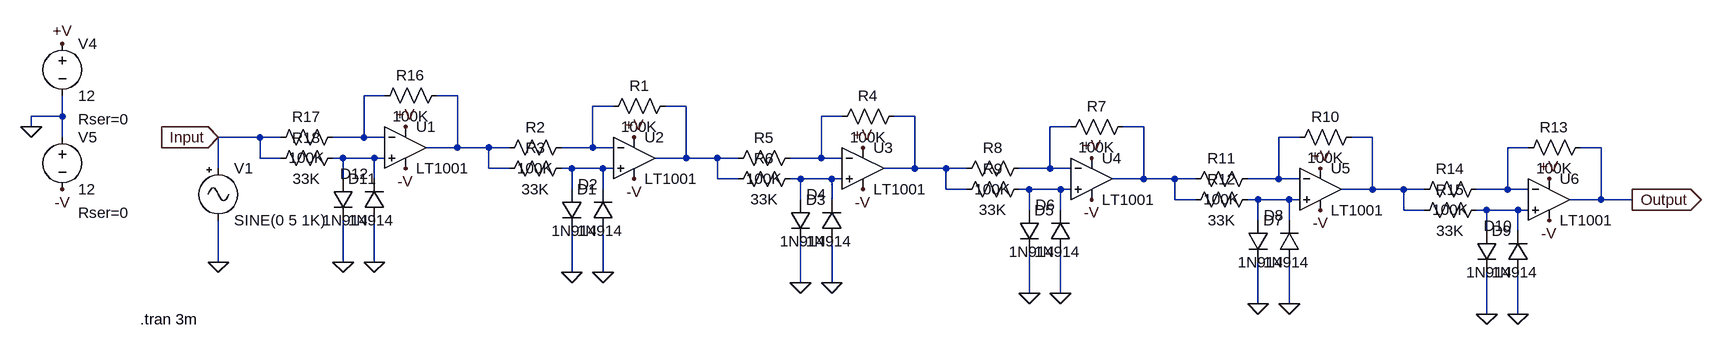
[diagram p0: schematic Serge%20ws2.asc]
Serge%20ws2.asc, the LTspice schematic file:
Version 4
SHEET 1 2140 680
WIRE 80 160 48 160
WIRE 192 160 160 160
WIRE 432 176 400 176
WIRE 544 176 512 176
WIRE -416 192 -416 160
WIRE -416 192 -464 192
WIRE 784 192 752 192
WIRE 896 192 864 192
WIRE -464 208 -464 192
WIRE 1136 208 1104 208
WIRE 1248 208 1216 208
WIRE -416 224 -416 192
WIRE -112 224 -176 224
WIRE -80 224 -112 224
WIRE 48 224 48 160
WIRE 48 224 0 224
WIRE 80 224 48 224
WIRE 1488 224 1456 224
WIRE 1600 224 1568 224
WIRE 192 240 192 160
WIRE 192 240 144 240
WIRE 240 240 192 240
WIRE 272 240 240 240
WIRE 400 240 400 176
WIRE 400 240 352 240
WIRE 432 240 400 240
WIRE 1840 240 1808 240
WIRE 1952 240 1920 240
WIRE -112 256 -112 224
WIRE -80 256 -112 256
WIRE 16 256 0 256
WIRE 64 256 16 256
WIRE 80 256 64 256
WIRE 544 256 544 176
WIRE 544 256 496 256
WIRE 592 256 544 256
WIRE 624 256 592 256
WIRE 752 256 752 192
WIRE 752 256 704 256
WIRE 784 256 752 256
WIRE -176 272 -176 224
WIRE 240 272 240 240
WIRE 272 272 240 272
WIRE 368 272 352 272
WIRE 416 272 368 272
WIRE 432 272 416 272
WIRE 896 272 896 192
WIRE 896 272 848 272
WIRE 944 272 896 272
WIRE 976 272 944 272
WIRE 1104 272 1104 208
WIRE 1104 272 1056 272
WIRE 1136 272 1104 272
WIRE 16 288 16 256
WIRE 64 288 64 256
WIRE 592 288 592 256
WIRE 624 288 592 288
WIRE 720 288 704 288
WIRE 768 288 720 288
WIRE 784 288 768 288
WIRE 1248 288 1248 208
WIRE 1248 288 1200 288
WIRE 1296 288 1248 288
WIRE 1328 288 1296 288
WIRE 1456 288 1456 224
WIRE 1456 288 1408 288
WIRE 1488 288 1456 288
WIRE 368 304 368 272
WIRE 416 304 416 272
WIRE 944 304 944 272
WIRE 976 304 944 304
WIRE 1072 304 1056 304
WIRE 1120 304 1072 304
WIRE 1136 304 1120 304
WIRE 1600 304 1600 224
WIRE 1600 304 1552 304
WIRE 1648 304 1600 304
WIRE 1680 304 1648 304
WIRE 1808 304 1808 240
WIRE 1808 304 1760 304
WIRE 1840 304 1808 304
WIRE 720 320 720 288
WIRE 768 320 768 288
WIRE 1296 320 1296 288
WIRE 1328 320 1296 320
WIRE 1424 320 1408 320
WIRE 1472 320 1424 320
WIRE 1488 320 1472 320
WIRE 1952 320 1952 240
WIRE 1952 320 1904 320
WIRE 2000 320 1952 320
WIRE 1072 336 1072 304
WIRE 1120 336 1120 304
WIRE 1648 336 1648 304
WIRE 1680 336 1648 336
WIRE 1776 336 1760 336
WIRE 1824 336 1776 336
WIRE 1840 336 1824 336
WIRE 1424 352 1424 320
WIRE 1472 352 1472 320
WIRE 1776 368 1776 336
WIRE 1824 368 1824 336
WIRE -176 416 -176 352
WIRE 16 416 16 352
WIRE 64 416 64 352
WIRE 368 432 368 368
WIRE 416 432 416 368
WIRE 720 448 720 384
WIRE 768 448 768 384
WIRE 1072 464 1072 400
WIRE 1120 464 1120 400
WIRE 1424 480 1424 416
WIRE 1472 480 1472 416
WIRE 1776 496 1776 432
WIRE 1824 496 1824 432
FLAG -176 224 Input
IOPIN -176 224 In
FLAG -176 416 0
FLAG -464 208 0
FLAG -416 80 +V
FLAG -416 304 -V
FLAG 16 416 0
FLAG 64 416 0
FLAG 112 208 +V
FLAG 112 272 -V
FLAG 2000 320 Output
IOPIN 2000 320 Out
FLAG 368 432 0
FLAG 416 432 0
FLAG 464 224 +V
FLAG 464 288 -V
FLAG 720 448 0
FLAG 768 448 0
FLAG 816 240 +V
FLAG 816 304 -V
FLAG 1072 464 0
FLAG 1120 464 0
FLAG 1168 256 +V
FLAG 1168 320 -V
FLAG 1424 480 0
FLAG 1472 480 0
FLAG 1520 272 +V
FLAG 1520 336 -V
FLAG 1776 496 0
FLAG 1824 496 0
FLAG 1872 288 +V
FLAG 1872 352 -V
SYMBOL Misc\\signal -176 256 R0
WINDOW 123 0 0 Left 0
WINDOW 39 0 0 Left 0
SYMATTR InstName V1
SYMATTR Value SINE(0 5 1K)
SYMBOL voltage -416 64 R0
WINDOW 123 0 0 Left 0
WINDOW 39 24 132 Left 0
SYMATTR SpiceLine Rser=0
SYMATTR InstName V4
SYMATTR Value 12
SYMBOL voltage -416 208 R0
WINDOW 123 0 0 Left 0
WINDOW 39 24 132 Left 0
SYMATTR SpiceLine Rser=0
SYMATTR InstName V5
SYMATTR Value 12
SYMBOL res 176 144 R90
WINDOW 0 0 56 VBottom 0
WINDOW 3 32 56 VTop 0
SYMATTR InstName R16
SYMATTR Value 100K
SYMBOL res 16 208 R90
WINDOW 0 0 56 VBottom 0
WINDOW 3 32 56 VTop 0
SYMATTR InstName R17
SYMATTR Value 100K
SYMBOL res 16 240 R90
WINDOW 0 0 56 VBottom 0
WINDOW 3 32 56 VTop 0
SYMATTR InstName R18
SYMATTR Value 33K
SYMBOL diode 0 288 R0
SYMATTR InstName D11
SYMATTR Value 1N914
SYMBOL diode 80 352 R180
WINDOW 0 24 72 Left 0
WINDOW 3 24 0 Left 0
SYMATTR InstName D12
SYMATTR Value 1N914
SYMBOL Opamps\\LT1001 112 176 R0
SYMATTR InstName U1
SYMBOL res 528 160 R90
WINDOW 0 0 56 VBottom 0
WINDOW 3 32 56 VTop 0
SYMATTR InstName R1
SYMATTR Value 100K
SYMBOL res 368 224 R90
WINDOW 0 0 56 VBottom 0
WINDOW 3 32 56 VTop 0
SYMATTR InstName R2
SYMATTR Value 100K
SYMBOL res 368 256 R90
WINDOW 0 0 56 VBottom 0
WINDOW 3 32 56 VTop 0
SYMATTR InstName R3
SYMATTR Value 33K
SYMBOL diode 352 304 R0
SYMATTR InstName D1
SYMATTR Value 1N914
SYMBOL diode 432 368 R180
WINDOW 0 24 72 Left 0
WINDOW 3 24 0 Left 0
SYMATTR InstName D2
SYMATTR Value 1N914
SYMBOL Opamps\\LT1001 464 192 R0
SYMATTR InstName U2
SYMBOL res 880 176 R90
WINDOW 0 0 56 VBottom 0
WINDOW 3 32 56 VTop 0
SYMATTR InstName R4
SYMATTR Value 100K
SYMBOL res 720 240 R90
WINDOW 0 0 56 VBottom 0
WINDOW 3 32 56 VTop 0
SYMATTR InstName R5
SYMATTR Value 100K
SYMBOL res 720 272 R90
WINDOW 0 0 56 VBottom 0
WINDOW 3 32 56 VTop 0
SYMATTR InstName R6
SYMATTR Value 33K
SYMBOL diode 704 320 R0
SYMATTR InstName D3
SYMATTR Value 1N914
SYMBOL diode 784 384 R180
WINDOW 0 24 72 Left 0
WINDOW 3 24 0 Left 0
SYMATTR InstName D4
SYMATTR Value 1N914
SYMBOL Opamps\\LT1001 816 208 R0
SYMATTR InstName U3
SYMBOL res 1232 192 R90
WINDOW 0 0 56 VBottom 0
WINDOW 3 32 56 VTop 0
SYMATTR InstName R7
SYMATTR Value 100K
SYMBOL res 1072 256 R90
WINDOW 0 0 56 VBottom 0
WINDOW 3 32 56 VTop 0
SYMATTR InstName R8
SYMATTR Value 100K
SYMBOL res 1072 288 R90
WINDOW 0 0 56 VBottom 0
WINDOW 3 32 56 VTop 0
SYMATTR InstName R9
SYMATTR Value 33K
SYMBOL diode 1056 336 R0
SYMATTR InstName D5
SYMATTR Value 1N914
SYMBOL diode 1136 400 R180
WINDOW 0 24 72 Left 0
WINDOW 3 24 0 Left 0
SYMATTR InstName D6
SYMATTR Value 1N914
SYMBOL Opamps\\LT1001 1168 224 R0
SYMATTR InstName U4
SYMBOL res 1584 208 R90
WINDOW 0 0 56 VBottom 0
WINDOW 3 32 56 VTop 0
SYMATTR InstName R10
SYMATTR Value 100K
SYMBOL res 1424 272 R90
WINDOW 0 0 56 VBottom 0
WINDOW 3 32 56 VTop 0
SYMATTR InstName R11
SYMATTR Value 100K
SYMBOL res 1424 304 R90
WINDOW 0 0 56 VBottom 0
WINDOW 3 32 56 VTop 0
SYMATTR InstName R12
SYMATTR Value 33K
SYMBOL diode 1408 352 R0
SYMATTR InstName D7
SYMATTR Value 1N914
SYMBOL diode 1488 416 R180
WINDOW 0 24 72 Left 0
WINDOW 3 24 0 Left 0
SYMATTR InstName D8
SYMATTR Value 1N914
SYMBOL Opamps\\LT1001 1520 240 R0
SYMATTR InstName U5
SYMBOL res 1936 224 R90
WINDOW 0 0 56 VBottom 0
WINDOW 3 32 56 VTop 0
SYMATTR InstName R13
SYMATTR Value 100K
SYMBOL res 1776 288 R90
WINDOW 0 0 56 VBottom 0
WINDOW 3 32 56 VTop 0
SYMATTR InstName R14
SYMATTR Value 100K
SYMBOL res 1776 320 R90
WINDOW 0 0 56 VBottom 0
WINDOW 3 32 56 VTop 0
SYMATTR InstName R15
SYMATTR Value 33K
SYMBOL diode 1760 368 R0
SYMATTR InstName D9
SYMATTR Value 1N914
SYMBOL diode 1840 432 R180
WINDOW 0 24 72 Left 0
WINDOW 3 24 0 Left 0
SYMATTR InstName D10
SYMATTR Value 1N914
SYMBOL Opamps\\LT1001 1872 256 R0
SYMATTR InstName U6
TEXT -296 504 Left 0 !.tran 3m

The netlist it stands for:
* Serge%20ws2.asc
V1 Input 0 SINE(0 5 1K)
V4 +V 0 12 Rser=0
V5 0 -V 12 Rser=0
R16 N002 N001 100K
R17 N001 Input 100K
R18 N012 Input 33K
D11 N012 0 1N914
D12 0 N012 1N914
XU1 N012 N001 +V -V N002 LT1001  ; pins In+ In- V+ V- OUT
R1 N004 N003 100K
R2 N003 N002 100K
R3 N013 N002 33K
D1 N013 0 1N914
D2 0 N013 1N914
XU2 N013 N003 +V -V N004 LT1001  ; pins In+ In- V+ V- OUT
R4 N006 N005 100K
R5 N005 N004 100K
R6 N014 N004 33K
D3 N014 0 1N914
D4 0 N014 1N914
XU3 N014 N005 +V -V N006 LT1001  ; pins In+ In- V+ V- OUT
R7 N008 N007 100K
R8 N007 N006 100K
R9 N015 N006 33K
D5 N015 0 1N914
D6 0 N015 1N914
XU4 N015 N007 +V -V N008 LT1001  ; pins In+ In- V+ V- OUT
R10 N010 N009 100K
R11 N009 N008 100K
R12 N016 N008 33K
D7 N016 0 1N914
D8 0 N016 1N914
XU5 N016 N009 +V -V N010 LT1001  ; pins In+ In- V+ V- OUT
R13 Output N011 100K
R14 N011 N010 100K
R15 N017 N010 33K
D9 N017 0 1N914
D10 0 N017 1N914
XU6 N017 N011 +V -V Output LT1001  ; pins In+ In- V+ V- OUT
.model D D
.lib standard.dio
.tran 3m
.lib LTC.lib
.backanno
.end